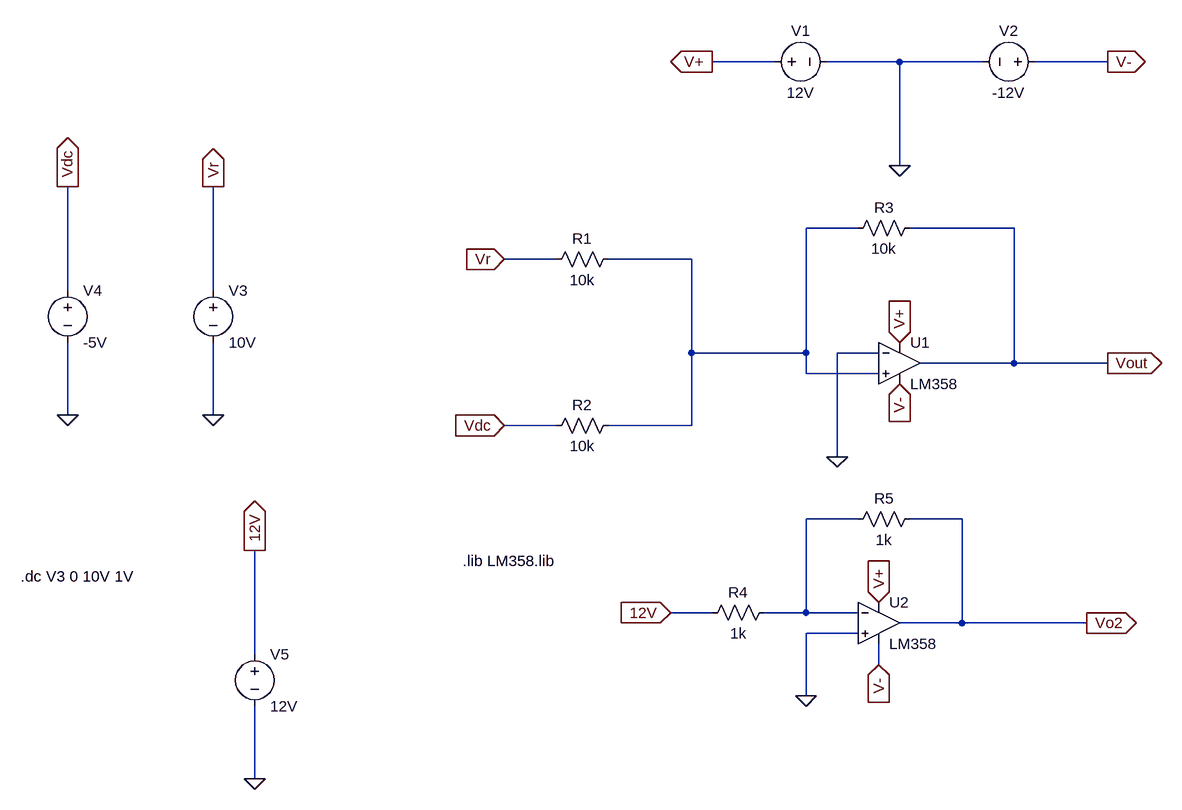
[diagram p0: schematic emulator-triangle-shift-ct-sim-2.asc]
emulator-triangle-shift-ct-sim-2.asc, the LTspice schematic file:
Version 4
SHEET 1 1056 820
WIRE 16 -304 -80 -304
WIRE 208 -304 96 -304
WIRE 336 -304 208 -304
WIRE 528 -304 416 -304
WIRE 208 -144 208 -304
WIRE 144 -48 64 -48
WIRE 384 -48 224 -48
WIRE -320 0 -400 0
WIRE -112 0 -240 0
WIRE -1072 48 -1072 -112
WIRE -848 48 -848 -112
WIRE -112 144 -112 0
WIRE 64 144 64 -48
WIRE 64 144 -112 144
WIRE 176 144 112 144
WIRE 384 160 384 -48
WIRE 384 160 240 160
WIRE 528 160 384 160
WIRE 64 176 64 144
WIRE 176 176 64 176
WIRE -1072 240 -1072 128
WIRE -848 240 -848 128
WIRE -320 256 -400 256
WIRE -112 256 -112 144
WIRE -112 256 -240 256
WIRE 112 304 112 144
WIRE 144 400 64 400
WIRE 304 400 224 400
WIRE -80 544 -144 544
WIRE 64 544 64 400
WIRE 64 544 0 544
WIRE 144 544 64 544
WIRE 304 560 304 400
WIRE 304 560 208 560
WIRE 496 560 304 560
WIRE 144 576 64 576
WIRE -784 608 -784 448
WIRE 176 624 176 592
WIRE 64 672 64 576
WIRE -784 800 -784 688
FLAG 208 -144 0
FLAG -80 -304 V+
IOPIN -80 -304 Out
FLAG 528 -304 V-
IOPIN 528 -304 Out
FLAG 208 128 V+
IOPIN 208 128 In
FLAG 208 192 V-
IOPIN 208 192 In
FLAG -400 0 Vr
IOPIN -400 0 In
FLAG -400 256 Vdc
IOPIN -400 256 In
FLAG 112 304 0
FLAG 528 160 Vout
IOPIN 528 160 Out
FLAG -848 240 0
FLAG -848 -112 Vr
IOPIN -848 -112 Out
FLAG -1072 240 0
FLAG -1072 -112 Vdc
IOPIN -1072 -112 Out
FLAG 176 528 V+
IOPIN 176 528 In
FLAG -784 800 0
FLAG -784 448 12V
IOPIN -784 448 Out
FLAG 496 560 Vo2
IOPIN 496 560 Out
FLAG 64 672 0
FLAG -144 544 12V
IOPIN -144 544 In
FLAG 176 624 V-
IOPIN 176 624 In
SYMBOL OpAmps\\opamp2 208 96 R0
SYMATTR InstName U1
SYMATTR Value LM358
SYMBOL voltage 0 -304 R270
WINDOW 0 32 56 VTop 2
WINDOW 3 -32 56 VBottom 2
SYMATTR InstName V1
SYMATTR Value 12V
SYMBOL voltage 432 -304 R90
WINDOW 0 -32 56 VBottom 2
WINDOW 3 32 56 VTop 2
SYMATTR InstName V2
SYMATTR Value -12V
SYMBOL res -224 -16 R90
WINDOW 0 0 56 VBottom 2
WINDOW 3 32 56 VTop 2
SYMATTR InstName R1
SYMATTR Value 10k
SYMBOL res -224 240 R90
WINDOW 0 0 56 VBottom 2
WINDOW 3 32 56 VTop 2
SYMATTR InstName R2
SYMATTR Value 10k
SYMBOL res 240 -64 R90
WINDOW 0 0 56 VBottom 2
WINDOW 3 32 56 VTop 2
SYMATTR InstName R3
SYMATTR Value 10k
SYMBOL voltage -848 32 R0
SYMATTR InstName V3
SYMATTR Value 10V
SYMBOL voltage -1072 32 R0
SYMATTR InstName V4
SYMATTR Value -5V
SYMBOL OpAmps\\opamp2 176 496 R0
SYMATTR InstName U2
SYMATTR Value LM358
SYMBOL voltage -784 592 R0
SYMATTR InstName V5
SYMATTR Value 12V
SYMBOL res 16 528 R90
WINDOW 0 0 56 VBottom 2
WINDOW 3 32 56 VTop 2
SYMATTR InstName R4
SYMATTR Value 1k
SYMBOL res 240 384 R90
WINDOW 0 0 56 VBottom 2
WINDOW 3 32 56 VTop 2
SYMATTR InstName R5
SYMATTR Value 1k
TEXT -464 464 Left 2 !.lib LM358.lib
TEXT -1144 488 Left 2 !.dc V3 0 10V 1V

The netlist it stands for:
* emulator-triangle-shift-ct-sim-2.asc
XU1 N001 0 V+ V- Vout LM358  ; pins In+ In- V+ V- OUT
V1 V+ 0 12V
V2 V- 0 -12V
R1 N001 Vr 10k
R2 N001 Vdc 10k
R3 Vout N001 10k
V3 Vr 0 10V
V4 Vdc 0 -5V
XU2 0 N002 V+ V- Vo2 LM358  ; pins In+ In- V+ V- OUT
V5 12V 0 12V
R4 N002 12V 1k
R5 Vo2 N002 1k
.lib LM358.lib
.dc V3 0 10V 1V
.backanno
.end

* Results of the author's LTspice run, read from the files saved beside the schematic
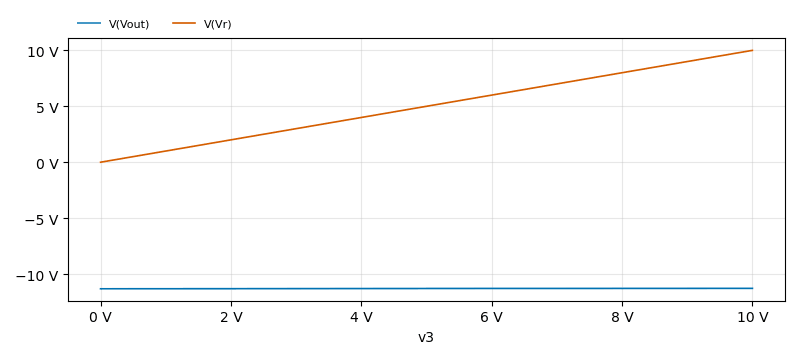
[diagram p1: DC transfer characteristic of emulator-triangle-shift-ct-sim-2.asc, plotted from the saved traces]
* DC transfer characteristic, 1 run:
*   V(Vout): -11.32 V at v3=0 V, -11.28 V at v3=10 V, min -11.32 V, max -11.28 V
*   V(Vr): 0 V at v3=0 V, 10 V at v3=10 V, min 0 V, max 10 V